# Altium schematic sheet IO_IIC.SchDoc
size A3
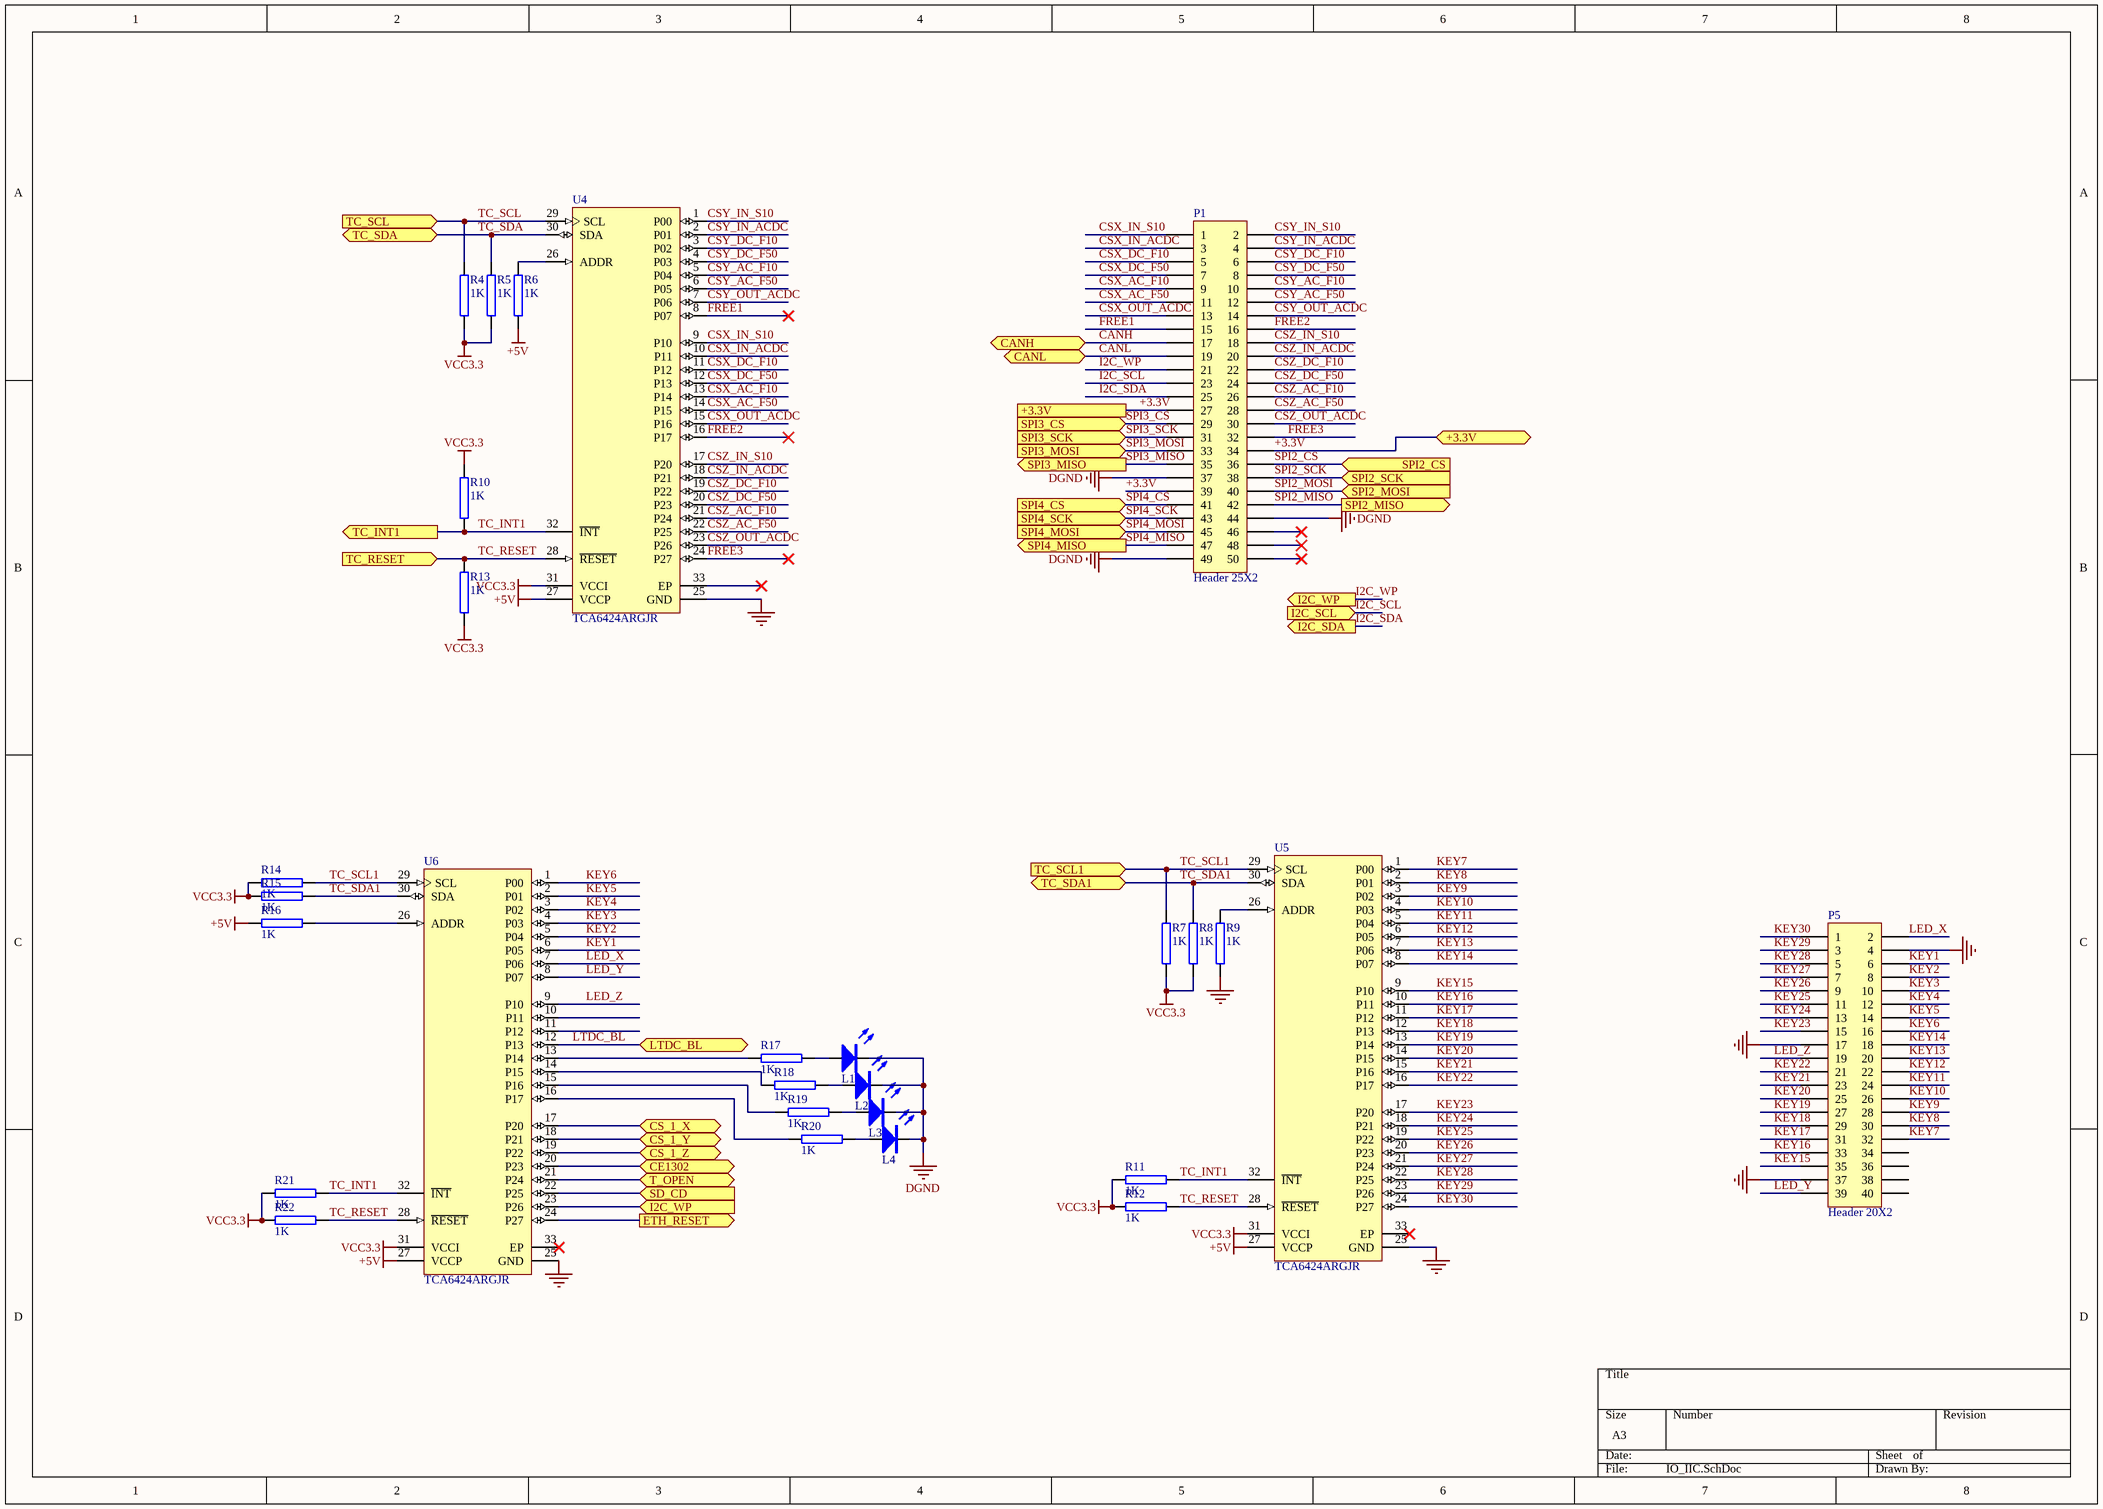
[diagram p0: IO_IIC.SchDoc]

## Parts
L1  LED  [0805LED]  (value not drawn)
L2  LED  [0805LED]  (value not drawn)
L3  LED  [0805LED]  (value not drawn)
L4  LED  [0805LED]  (value not drawn)
P1  Header 25X2  [HDR2X25]
P5  Header 20X2  [HDR2X20]
R4  1K  [0603]
R5  1K  [0603]
R6  1K  [0603]
R7  1K  [0603]
R8  1K  [0603]
R9  1K  [0603]
R10  1K  [0603]
R11  1K  [0603]
R12  1K  [0603]
R13  1K  [0603]
R14  1K  [0603]
R15  1K  [0603]
R16  1K  [0603]
R17  1K  [0603]
R18  1K  [0603]
R19  1K  [0603]
R20  1K  [0603]
R21  1K  [0603]
R22  1K  [0603]
U4  TCA6424ARGJR  [TCA6424A-QFN32]
U5  TCA6424ARGJR  [TCA6424A-QFN32]
U6  TCA6424ARGJR  [TCA6424A-QFN32]

## Ports
+3.3V, CANH, CANL, CE1302 (bidir), CS_1_X (bidir), CS_1_Y (bidir), CS_1_Z (bidir), ETH_RESET (out), I2C_SCL (in), I2C_SDA (out), I2C_WP (in), I2C_WP (out), LTDC_BL, SD_CD (in), SPI2_CS (in), SPI2_MISO (out), SPI2_MOSI (in), SPI2_SCK (in), SPI3_CS (in), SPI3_MISO (out), SPI3_MOSI (in), SPI3_SCK (in), SPI4_CS (in), SPI4_MISO (out), SPI4_MOSI (in), SPI4_SCK (in), T_OPEN (bidir), TC_INT1 (out), TC_RESET (in), TC_SCL1 (in), TC_SCL (in), TC_SDA1 (bidir), TC_SDA (bidir)

## Nets
+5V: R6.2 R16.2 U4.27(VCCP) U5.27(VCCP) U6.27(VCCP)
DGND: L1.2(K) L2.2(K) L3.2(K) L4.2(K) P1.37 P1.44 P1.49 P5.4 P5.17 P5.37 R9.2 U4.25(GND) U5.25(GND) U6.25(GND)
VCC3.3: R4.2 R5.2 R7.2 R8.2 R10.2 R11.2 R12.2 R13.1 R14.2 R15.2 R21.2 R22.2 U4.31(VCCI) U5.31(VCCI) U6.31(VCCI)
+3.3V: P1.27 P1.34 P1.39 ; port +3.3V
CANH: P1.17 ; port CANH
CANL: P1.19 ; port CANL
CE1302: U6.20(P23) ; port CE1302
CS_1_X: U6.17(P20) ; port CS_1_X
CS_1_Y: U6.18(P21) ; port CS_1_Y
CS_1_Z: U6.19(P22) ; port CS_1_Z
CSX_AC_F10: P1.9 U4.13(P14)
CSX_AC_F50: P1.11 U4.14(P15)
CSX_DC_F10: P1.5 U4.11(P12)
CSX_DC_F50: P1.7 U4.12(P13)
CSX_IN_ACDC: P1.3 U4.10(P11)
CSX_IN_S10: P1.1 U4.9(P10)
CSX_OUT_ACDC: P1.13 U4.15(P16)
CSY_AC_F10: P1.10 U4.5(P04)
CSY_AC_F50: P1.12 U4.6(P05)
CSY_DC_F10: P1.6 U4.3(P02)
CSY_DC_F50: P1.8 U4.4(P03)
CSY_IN_ACDC: P1.4 U4.2(P01)
CSY_IN_S10: P1.2 U4.1(P00)
CSY_OUT_ACDC: P1.14 U4.7(P06)
CSZ_AC_F10: P1.26 U4.21(P24)
CSZ_AC_F50: P1.28 U4.22(P25)
CSZ_DC_F10: P1.22 U4.19(P22)
CSZ_DC_F50: P1.24 U4.20(P23)
CSZ_IN_ACDC: P1.20 U4.18(P21)
CSZ_IN_S10: P1.18 U4.17(P20)
CSZ_OUT_ACDC: P1.30 U4.23(P26)
ETH_RESET: U6.24(P27) ; port ETH_RESET
FREE1: P1.15 U4.8(P07)
FREE2: P1.16 U4.16(P17)
FREE3: P1.32 U4.24(P27)
I2C_SCL: P1.23 ; port I2C_SCL
I2C_SDA: P1.25 ; port I2C_SDA
I2C_WP: P1.21 U6.23(P26) ; port I2C_WP
KEY1: P5.6 U6.6(P05)
KEY2: P5.8 U6.5(P04)
KEY3: P5.10 U6.4(P03)
KEY4: P5.12 U6.3(P02)
KEY5: P5.14 U6.2(P01)
KEY6: P5.16 U6.1(P00)
KEY7: P5.32 U5.1(P00)
KEY8: P5.30 U5.2(P01)
KEY9: P5.28 U5.3(P02)
KEY10: P5.26 U5.4(P03)
KEY11: P5.24 U5.5(P04)
KEY12: P5.22 U5.6(P05)
KEY13: P5.20 U5.7(P06)
KEY14: P5.18 U5.8(P07)
KEY15: P5.35 U5.9(P10)
KEY16: P5.33 U5.10(P11)
KEY17: P5.31 U5.11(P12)
KEY18: P5.29 U5.12(P13)
KEY19: P5.27 U5.13(P14)
KEY20: P5.25 U5.14(P15)
KEY21: P5.23 U5.15(P16)
KEY22: P5.21 U5.16(P17)
KEY23: P5.15 U5.17(P20)
KEY24: P5.13 U5.18(P21)
KEY25: P5.11 U5.19(P22)
KEY26: P5.9 U5.20(P23)
KEY27: P5.7 U5.21(P24)
KEY28: P5.5 U5.22(P25)
KEY29: P5.3 U5.23(P26)
KEY30: P5.1 U5.24(P27)
LED_X: P5.2 U6.7(P06)
LED_Y: P5.39 U6.8(P07)
LED_Z: P5.19 U6.9(P10)
LTDC_BL: U6.12(P13) ; port LTDC_BL
SD_CD: U6.22(P25) ; port SD_CD
SPI2_CS: P1.36 ; port SPI2_CS
SPI2_MISO: P1.42 ; port SPI2_MISO
SPI2_MOSI: P1.40 ; port SPI2_MOSI
SPI2_SCK: P1.38 ; port SPI2_SCK
SPI3_CS: P1.29 ; port SPI3_CS
SPI3_MISO: P1.35 ; port SPI3_MISO
SPI3_MOSI: P1.33 ; port SPI3_MOSI
SPI3_SCK: P1.31 ; port SPI3_SCK
SPI4_CS: P1.41 ; port SPI4_CS
SPI4_MISO: P1.47 ; port SPI4_MISO
SPI4_MOSI: P1.45 ; port SPI4_MOSI
SPI4_SCK: P1.43 ; port SPI4_SCK
T_OPEN: U6.21(P24) ; port T_OPEN
TC_INT1: R10.1 R11.1 R21.1 U4.32(~{INT}) U5.32(~{INT}) U6.32(~{INT}) ; port TC_INT1
TC_RESET: R12.1 R13.2 R22.1 U4.28(~{RESET}) U5.28(~{RESET}) U6.28(~{RESET}) ; port TC_RESET
TC_SCL: R4.1 U4.29(SCL) ; port TC_SCL
TC_SCL1: R7.1 R14.1 U5.29(SCL) U6.29(SCL) ; port TC_SCL1
TC_SDA: R5.1 U4.30(SDA) ; port TC_SDA
TC_SDA1: R8.1 R15.1 U5.30(SDA) U6.30(SDA) ; port TC_SDA1
NetL1_1: L1.1(A) R17.1
NetL2_1: L2.1(A) R18.1
NetL3_1: L3.1(A) R19.1
NetL4_1: L4.1(A) R20.1
NetR6_1: R6.1 U4.26(ADDR)
NetR9_1: R9.1 U5.26(ADDR)
NetR16_1: R16.1 U6.26(ADDR)
NetR17_2: R17.2 U6.13(P14)
NetR18_2: R18.2 U6.14(P15)
NetR19_2: R19.2 U6.15(P16)
NetR20_2: R20.2 U6.16(P17)

Not connected (* = marked no-connect by the designer): P1 46* 48* 50*; P5 34 36 38 40; U4 33(EP)*; U5 33(EP)*; U6 10(P11) 11(P12) 33(EP)*

## Library data of the parts
P1 = Header 25X2: Header, 25-Pin, Dual row; LatestRevisionDate: 17-Jul-2002; LatestRevisionNote: Re-released for DXP Platform.; Publisher: Altium Limited
P5 = Header 20X2: Header, 20-Pin, Dual row; LatestRevisionDate: 17-Jul-2002; LatestRevisionNote: Re-released for DXP Platform.; Publisher: Altium Limited
R4-R22 = RES
U4-U6 = TCA6424ARGJR: Low-Voltage 24-Bit I2C and SMBus I/O Expander, 24 Outputs, 1.65 to 5.5 V, -40 to 85 degC, 32-pin UQFN (RGJ), Green (RoHS & no Sb/Br); Manufacturer: Texas Instruments; SubFamily: I2C IO Expander; No. of Outputs: 24; Interrupt Output: Yes; VCC(Min)(V): 1.65; VCC(Max)(V): 5.5; Max Frequency(kHz): 400; I2C Address: 0100 01x; DatasheetVersion: SCPS193B; PackageVersion: revD, Apr-2011; PackageReference: RGJ32-3150X3150TP; PackageDescription: 32-Pin Plastic Quad Flatpack No-Lead, 5 x 5 mm Body, 0.5 mm Pitch; Supplier 1: Digi-Key; Supplier Part Number 1: 296-27844-2-ND; Supplier 2: Digi-Key; Supplier Part Number 2: 296-27844-1-ND; Supplier 3: Digi-Key; Supplier Part Number 3: 296-27844-6-ND; Supplier 4: Farnell; Supplier Part Number 4: 1863866; Supplier 5: Newark; Supplier Part Number 5: 01T0713; Supplier 6: Mouser; Supplier Part Number 6: 595-TCA6424ARGJR; Eco-Plan: Green (RoHS & no Sb/Br); Reset Input: Yes; # of I/Os: 24; Vcc range(V): 1.65 to 5.5; Low Power: Yes; Configuration Registers: Yes; 5V Tolerant I/O: Yes; Push-Pull I/O Type: Yes; Mounting Technology: Surface Mount; PartNumber: TCA6424ARGJR; Code_JEDEC: MO-248-UHHD-1*; ComponentLink1Description: Datasheet; ComponentLink1URL: http://www.ti.com/general/docs/lit/getliterature.tsp?genericPartNumber=TCA6424A&fileType=pdf; ComponentLink2Description: Package Specification; ComponentLink2URL: http://www.ti.com/litv/pdf/mpqf183c